# Altium schematic sheet LT4320_1.SchDoc
size A4
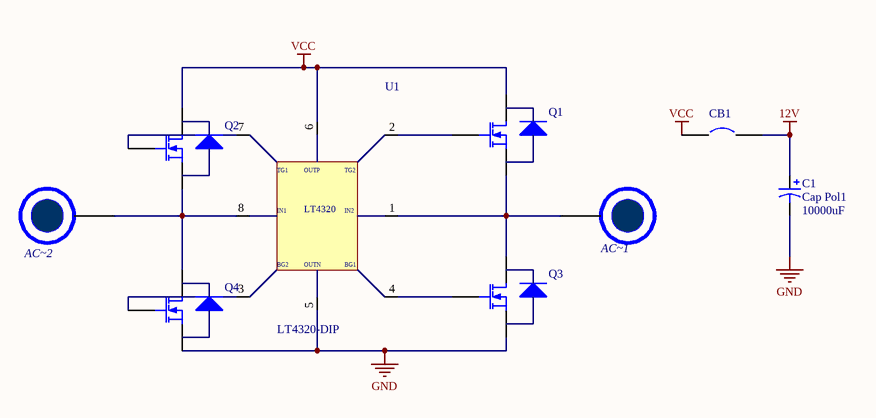
[diagram p0: LT4320_1.SchDoc]

## Parts
AC~1  PIN  [PIN]  (value not drawn)
AC~2  PIN  [PIN]  (value not drawn)
C1  Cap Pol1  value 10000uF  [RB7.6-15]
CB1  Circuit Breaker  [SPST-2]  (value not drawn)
Q1  MOSFET-N  [mos]  (value not drawn)
Q2  MOSFET-N  [mos]  (value not drawn)
Q3  MOSFET-N  [mos]  (value not drawn)
Q4  MOSFET-N  [mos]  (value not drawn)
U1  LT4320-DIP  [DIP-8]

## Nets
12V: C1.1 CB1.2
GND: C1.2 Q3.3(S) Q4.3(S) U1.5
VCC: CB1.1 Q1.2(D) Q2.2(D) U1.6
NetAC~1_1: AC~1.1(PIN) Q1.3(S) Q3.2(D) U1.1
NetAC~2_1: AC~2.1(PIN) Q2.3(S) Q4.2(D) U1.8
NetQ1_1: Q1.1(G) U1.2
NetQ2_1: Q2.1(G) U1.7
NetQ3_1: Q3.1(G) U1.4
NetQ4_1: Q4.1(G) U1.3

## Notes on the sheet
- (in symbol LT4320-DIP) TG1; OUTP; TG2; IN1; LT4320; IN2; BG2; OUTN; BG1

## Library data of the parts
C1 = Cap Pol1: Polarized Capacitor (Radial); Published: 8-Jun-2000; LatestRevisionDate: 17-Jul-2002; LatestRevisionNote: Re-released for DXP Platform.; PackageReference: RB7.6-15; Publisher: Altium Limited; PackageDescription: Polarized Capacitor (Radial); 2 Leads
Q1-Q4 = MOSFET-N: N-Channel MOSFET; PackageDocument: 1995/1996; Published: 8-Jun-2000; LatestRevisionDate: 17-Jul-2002; LatestRevisionNote: Re-released for DXP Platform.; PackageReference: E3; Publisher: Altium Limited
CB1 = Circuit Breaker: Published: 24-Mar-1999; LatestRevisionDate: 17-Jul-2002; LatestRevisionNote: Re-released for DXP Platform.; PackageReference: SPST-2; Publisher: Altium Limited; PackageDescription: Switch; 2 Leads